# Altium project eBox_main.PrjPcb
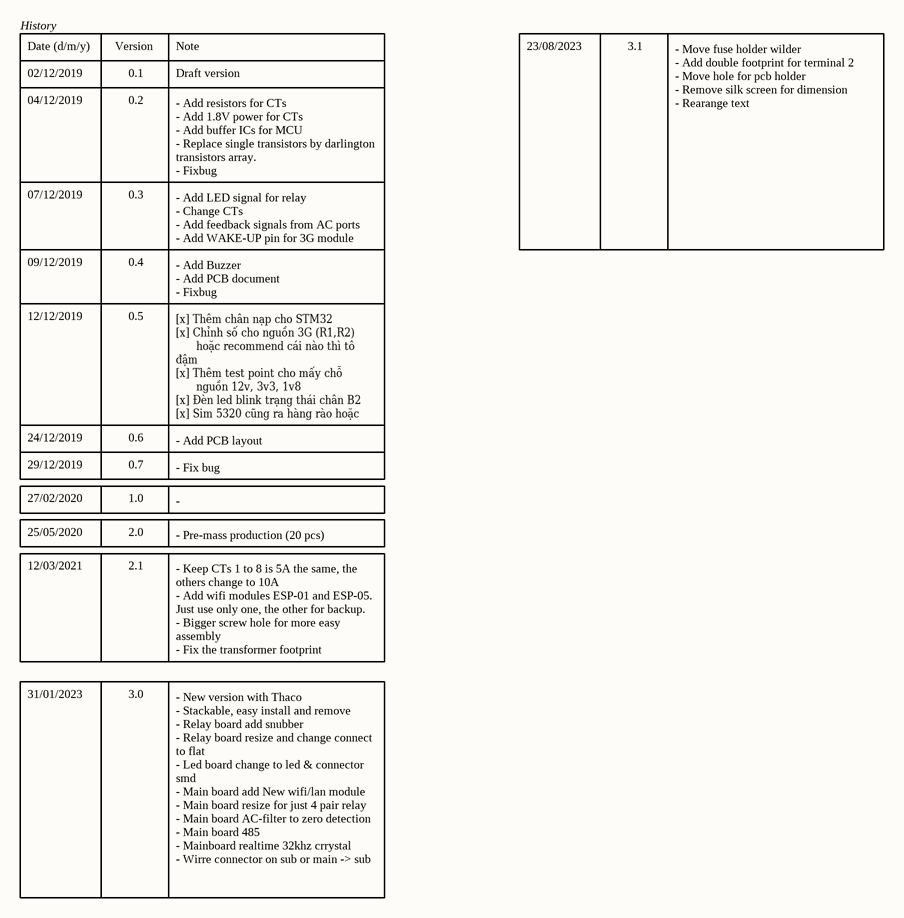
[diagram p0: eBox_Notes.SchDoc]
Version: 2.1; Hash: zVBbq2tk
3 sheets, 52 parts. Net scope: flat (ports and power ports of the same name join across sheets).
Board file: eBox_main.PcbDoc
Sheets:
  eBox_Notes.SchDoc
  eBox_3G.SchDoc
  eBox_ACdetect2.SchDoc

## Sheet eBox_Notes.SchDoc: eBox_Notes
size A4; DocumentNumber: 1; SheetNumber: 1; SheetTotal: 9

### Notes on the sheet
- History
- Date (d/m/y)
- 02/12/2019
- Version
- 0.1
- Note
- Draft version
- 23/08/2023
- 3.1
- 04/12/2019
- 0.2
- 07/12/2019
- 0.3
- - Add resistors for CTs
  - Add 1.8V power for CTs
  - Add buffer ICs for MCU
  - Replace single transistors by darlington  transistors array.
  - Fixbug
- - Move fuse holder wilder
  - Add double footprint for terminal 2
  - Move hole for pcb holder
  - Remove silk screen for dimension
  - Rearange text
- 09/12/2019
- 0.4
- - Add LED signal for relay
  - Change CTs
  - Add feedback signals from AC ports
  - Add WAKE-UP pin for 3G module
- 12/12/2019
- 0.5
- - Add Buzzer
  - Add PCB document
  - Fixbug
- [x] Thêm chân nạp cho STM32
  [x] Chỉnh số cho nguồn 3G (R1,R2)
  hoặc recommend cái nào thì tô đậm
  [x] Thêm test point cho mấy chỗ
  nguồn 12v, 3v3, 1v8
  [x] Đèn led blink trạng thái chân B2
  [x] Sim 5320 cũng ra hàng rào hoặc
  test point uart để test
- 24/12/2019
- 29/12/2019
- 0.6
- 0.7
- - Add PCB layout
- - Fix bug
- 27/02/2020
- 25/05/2020
- 1.0
- 2.0
- -
- - Pre-mass production (20 pcs)
- 12/03/2021
- 2.1
- - Keep CTs 1 to 8 is 5A the same, the others change to 10A
  - Add wifi modules ESP-01 and ESP-05. Just use only one, the other for backup.
  - Bigger screw hole for more easy assembly
  - Fix the transformer footprint
  - Use 5V power supply for the temperature sensor
- 31/01/2023
- 3.0
- - New version with Thaco
  - Stackable, easy install and remove
  - Relay board add snubber
  - Relay board resize and change connect to flat
  - Led board change to led & connector smd
  - Main board add New wifi/lan module
  - Main board resize for just 4 pair relay
  - Main board AC-filter to zero detection
  - Main board 485
  - Mainboard realtime 32khz crrystal
  - Wirre connector on sub or main -> sub
  - Main board remove 2 adc pins
  - Main board adc read  tight to ground and remove 1v8?
- Title
- Size:
- Date:
- A4
- Number:
- Time:
- Revision:
- Sheet
- of
- NPN
- Lab
- File:

## Sheet eBox_3G.SchDoc: eBox_3G
size A4; DocumentNumber: 5; SheetNumber: 5; SheetTotal: 9
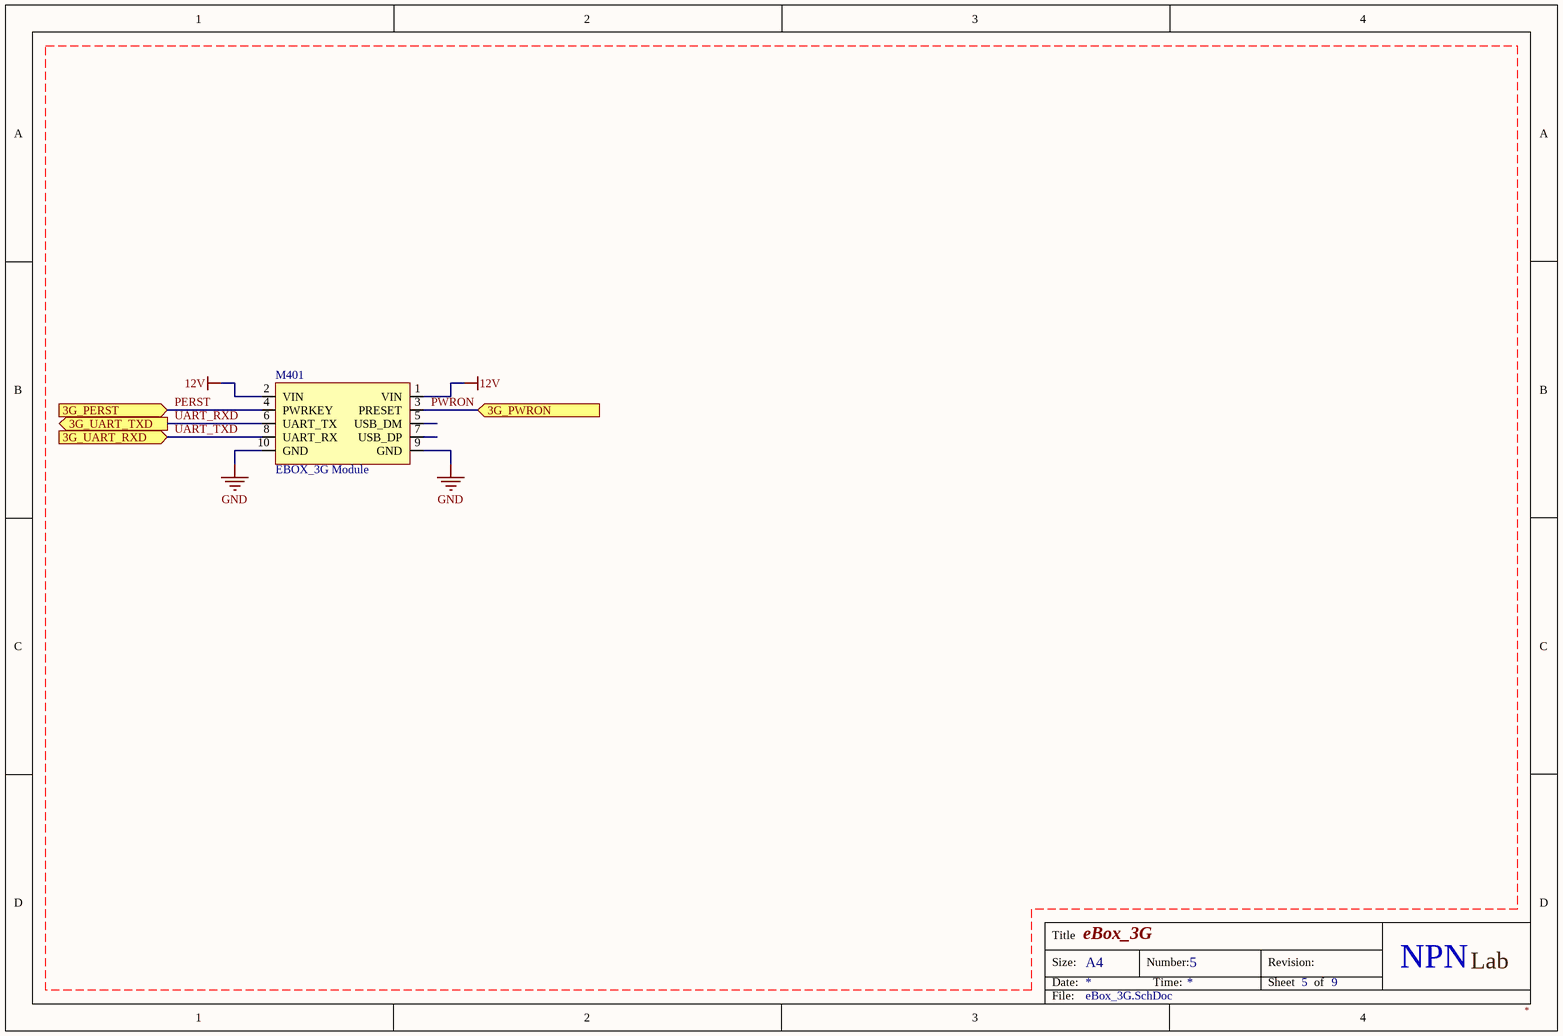
[diagram p1: eBox_3G.SchDoc]

### Parts
M401  EBOX_3G Module  [EBOX_3G]

### Ports
3G_PERST (in), 3G_PWRON (in), 3G_UART_RXD (in), 3G_UART_TXD (out)

### Nets
12V: M401.1(VIN) M401.2(VIN)
GND: M401.9(GND) M401.10(GND)
PERST: M401.4(PWRKEY) ; port 3G_PERST
PWRON: M401.3(PRESET) ; port 3G_PWRON
UART_RXD: M401.6(UART_TX) ; port 3G_UART_TXD
UART_TXD: M401.8(UART_RX) ; port 3G_UART_RXD

Not connected (* = marked no-connect by the designer): M401 5(USB_DM) 7(USB_DP)

### Notes on the sheet
- Title
- Size:
- Date:
- A4
- Number:
- Time:
- Revision:
- Sheet
- of
- NPN
- Lab
- File:

## Sheet eBox_ACdetect2.SchDoc: eBox_AC_Detect (2)
size A4; DocumentNumber: 7; SheetNumber: 7; SheetTotal: 9
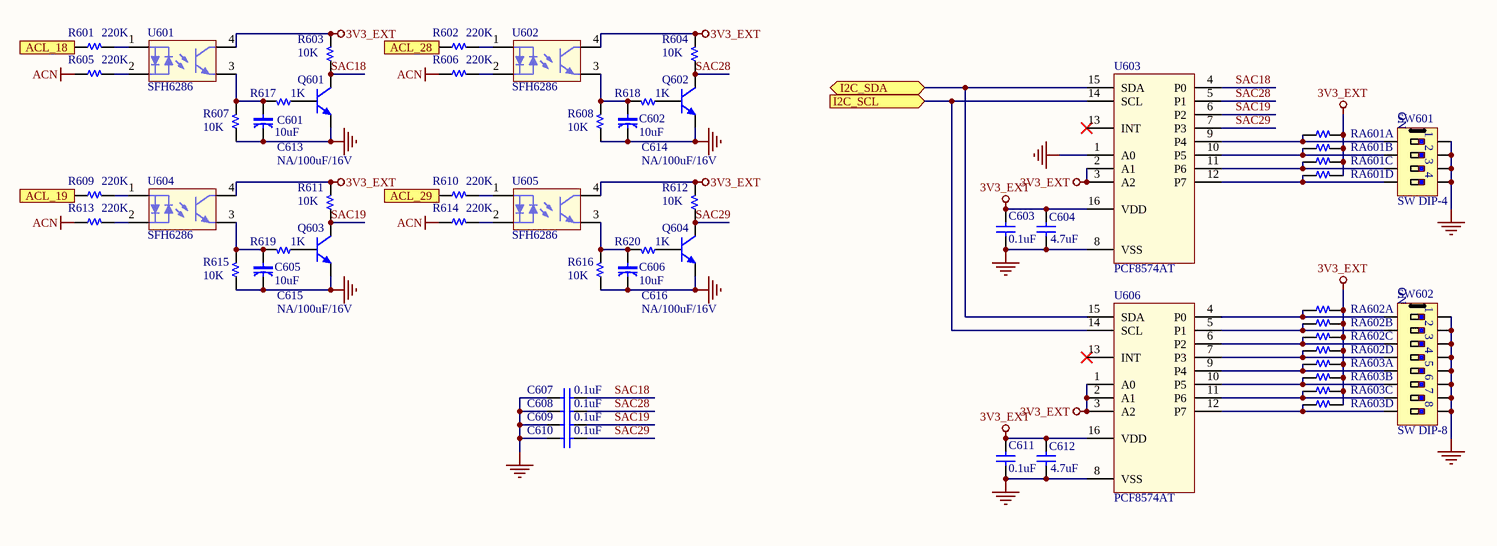
[diagram p2: eBox_ACdetect2.SchDoc]

### Parts
C601  10uF  [C 0805]
C602  10uF  [C 0805]
C603  0.1uF  [C 0603]
C604  4.7uF  [C 0603]
C605  10uF  [C 0805]
C606  10uF  [C 0805]
C607  0.1uF  [C 0805]
C608  0.1uF  [C 0805]
C609  0.1uF  [C 0805]
C610  0.1uF  [C 0805]
C611  0.1uF  [C 0603]
C612  4.7uF  [C 0603]
C613  NA/100uF/16V  [CYL/D.200/LS.75]
C614  NA/100uF/16V  [CYL/D.200/LS.75]
C615  NA/100uF/16V  [CYL/D.200/LS.75]
C616  NA/100uF/16V  [CYL/D.200/LS.75]
Q601  MMBT3904LT1G  [SOT-23]  (value not drawn)
Q602  MMBT3904LT1G  [SOT-23]  (value not drawn)
Q603  MMBT3904LT1G  [SOT-23]  (value not drawn)
Q604  MMBT3904LT1G  [SOT-23]  (value not drawn)
R601  220K  [R 0805]
R602  220K  [R 0805]
R603  10K  [R 0805]
R604  10K  [R 0805]
R605  220K  [R 0805]
R606  220K  [R 0805]
R607  10K  [R 0805]
R608  10K  [R 0805]
R609  220K  [R 0805]
R610  220K  [R 0805]
R611  10K  [R 0805]
R612  10K  [R 0805]
R613  220K  [R 0805]
R614  220K  [R 0805]
R615  10K  [R 0805]
R616  10K  [R 0805]
R617  1K  [R 0805]
R618  1K  [R 0805]
R619  1K  [R 0805]
R620  1K  [R 0805]
RA601  10K  [RAx4 1206 (3216)]  (value not drawn)  (parts A,B,C,D of 4)
RA602  10K  [RAx4 1206 (3216)]  (value not drawn)  (parts A,B,C,D of 4)
RA603  10K  [RAx4 1206 (3216)]  (value not drawn)  (parts A,B,C,D of 4)
SW601  SW DIP-4  [SW/DIP4]
SW602  SW DIP-8  [SW/DIP8/300]
U601  SFH6286  [SOP4 - SFH6286]
U602  SFH6286  [SOP4 - SFH6286]
U603  PCF8574AT  [SO16/PCF8574AT]
U604  SFH6286  [SOP4 - SFH6286]
U605  SFH6286  [SOP4 - SFH6286]
U606  PCF8574AT  [SO16/PCF8574AT]

### Ports
ACL_18 (in), ACL_19 (in), ACL_28 (in), ACL_29 (in), I2C_SCL (in), I2C_SDA (bidir)

### Nets
3V3_EXT: C603.1 C604.1 C611.1 C612.1 R603.2 R604.2 R611.2 R612.2 RA601.5 RA601.6 RA601.7 RA601.8 RA602.5 RA602.6 RA602.7 RA602.8 RA603.5 RA603.6 RA603.7 RA603.8 U601.4(C) U602.4(C) U603.2(A1) U603.3(A2) U603.16(VDD) U604.4(C) U605.4(C) U606.1(A0) U606.2(A1) U606.3(A2) U606.16(VDD)
ACN: R605.1 R606.1 R613.1 R614.1
GND: C601.2 C602.2 C603.2 C604.2 C605.2 C606.2 C607.1 C608.1 C609.1 C610.1 C611.2 C612.2 C613.2 C614.2 C615.2 C616.2 Q601.2(E) Q602.2(E) Q603.2(E) Q604.2(E) R607.1 R608.1 R615.1 R616.1 SW601.1 SW601.2 SW601.3 SW601.4 SW602.1 SW602.2 SW602.3 SW602.4 SW602.5 SW602.6 SW602.7 SW602.8 U603.1(A0) U603.8(VSS) U606.8(VSS)
SAC18: C607.2 Q601.3(C) R603.1 U603.4(P0)
SAC19: C609.2 Q603.3(C) R611.1 U603.6(P2)
SAC28: C608.2 Q602.3(C) R604.1 U603.5(P1)
SAC29: C610.2 Q604.3(C) R612.1 U603.7(P3)
NetC601_1: C601.1 C613.1 R607.2 R617.2 U601.3(E)
NetC602_1: C602.1 C614.1 R608.2 R618.2 U602.3(E)
NetC605_1: C605.1 C615.1 R615.2 R619.2 U604.3(E)
NetC606_1: C606.1 C616.1 R616.2 R620.2 U605.3(E)
NetQ601_1: Q601.1(B) R617.1
NetQ602_1: Q602.1(B) R618.1
NetQ603_1: Q603.1(B) R619.1
NetQ604_1: Q604.1(B) R620.1
NetR601_1: R601.1 ; port ACL_18
NetR601_2: R601.2 U601.1(A/C)
NetR602_1: R602.1 ; port ACL_28
NetR602_2: R602.2 U602.1(A/C)
NetR605_2: R605.2 U601.2(C/A)
NetR606_2: R606.2 U602.2(C/A)
NetR609_1: R609.1 ; port ACL_19
NetR609_2: R609.2 U604.1(A/C)
NetR610_1: R610.1 ; port ACL_29
NetR610_2: R610.2 U605.1(A/C)
NetR613_2: R613.2 U604.2(C/A)
NetR614_2: R614.2 U605.2(C/A)
NetRA601_1: RA601.1 SW601.8 U603.9(P4)
NetRA601_2: RA601.2 SW601.7 U603.10(P5)
NetRA601_3: RA601.3 SW601.6 U603.11(P6)
NetRA601_4: RA601.4 SW601.5 U603.12(P7)
NetRA602_1: RA602.1 SW602.16 U606.4(P0)
NetRA602_2: RA602.2 SW602.15 U606.5(P1)
NetRA602_3: RA602.3 SW602.14 U606.6(P2)
NetRA602_4: RA602.4 SW602.13 U606.7(P3)
NetRA603_1: RA603.1 SW602.12 U606.9(P4)
NetRA603_2: RA603.2 SW602.11 U606.10(P5)
NetRA603_3: RA603.3 SW602.10 U606.11(P6)
NetRA603_4: RA603.4 SW602.9 U606.12(P7)
NetU603_14: U603.14(SCL) U606.14(SCL) ; port I2C_SCL
NetU603_15: U603.15(SDA) U606.15(SDA) ; port I2C_SDA

Not connected (* = marked no-connect by the designer): U603 13(INT)*; U606 13(INT)*

### Notes on the sheet
- Title
- Size:
- Date:
- A4
- Number:
- Time:
- Revision:
- Sheet
- of
- NPN
- Lab
- File:
- (in symbol SW DIP-4) ON
- (in symbol SW DIP-8) ON

### Library data of the parts
C601 C602 C605-C610 = Capacitor NP: CAP CER 0.1UF 50V X7R 0805; TYPE: SMD; PACKAGE: SMD0805; STOCK CODE: CL21B104KBNC; SUPPLIER: tme.vn; STOCK DESC: 100nF/50V ±10% X7R SMD-0805 Capacitor; UNIT PRICE: 500
C603 C611 = Capacitor NP: CAP CER 0.1UF 50V X7R 0603; TYPE: SMD; PACKAGE: SMD0603; STOCK CODE: CC0603KRX7R9BB104; SUPPLIER: tme.vn; STOCK DESC: 100nF/50V ±10% X7R SMD-0603 Capacitor; UNIT PRICE: 400
C604 C612 = Capacitor NP: CAP CER 4.7UF 50V X7R 0603; TYPE: SMD; PACKAGE: SMD0603; STOCK CODE: CC0603KRX5R6BB475; SUPPLIER: tme.vn; STOCK DESC: 4.7uF 10V ±10% X5R SMD-0603 Capacitor; UNIT PRICE: 600
C613-C616 = Capacitor: CAP ALUM 100UF 20% 16V RADIAL; PACKAGE: 5x7 mm; STOCK CODE: 100uF/16V; SUPPLIER: tme.vn; TYPE: N/A; STOCK DESC: 100uF/16V ±20% Aluminum Electrolytic Capacitor, 5x7 mm; UNIT PRICE: 800
Q601-Q604 = Transistor NPN: TRANS NPN 40V 0.2A SOT23; TYPE: SMD; STOCK CODE: LMBT3904LT1G; SUPPLIER: tme.vn; STOCK DESC: NPN General-Purpose Amplifier SMD Transistor; UNIT PRICE: 600
R601 R602 R605 R606 R609 R610 R613 R614 = Resistor: RES SMD 220K OHM 1% 1/8W 0805; PACKAGE: SMD0805; STOCK CODE: RM10JTN224; SUPPLIER: tme.vn; TYPE: SMD; STOCK DESC: 220K 5% SMD-0805 Resistor; UNIT PRICE: 60
R603 R604 R607 R608 R611 R612 R615 R616 = Resistor: RES SMD 10K OHM 1% 1/8W 0805; PACKAGE: SMD0805; STOCK CODE: RM10JTN103; SUPPLIER: tme.vn; TYPE: SMD; STOCK DESC: 10K ±5% SMD-0805 Resistor; UNIT PRICE: 60
R617-R620 = Resistor: RES SMD 1K OHM 5% 1/8W 0805; PACKAGE: SMD0805; STOCK CODE: RM10JTN102; SUPPLIER: tme.vn; TYPE: SMD; STOCK DESC: 1K 5% SMD-0805 Resistor; UNIT PRICE: 60
RA601-RA603 = Resistor Array x4: 10K 1/10W 5% Chip Resistor Array (SMD0603x4); PACKAGE: SMD1206; STOCK CODE: 4D03WAJ0103T5E; SUPPLIER: tme.vn; TYPE: SMD; STOCK DESC: 10K 1/10W 5% Chip Resistor Array (SMD0603x4); UNIT PRICE: 150
U603 U606 = PCF8574AT: Remote 8-bit I/O expander for I2C-bus with interrupt; PART NO: PCF8574AT/3; BRAND: NXP; PACKAGE: SO16; SUPPLIER: CHINA; TYPE: SMD; UNIT PRICE: 6160
SW601 = SW DIP-4: PACKAGE: DIP8; STOCK CODE: DIPSW04-R; SUPPLIER: tme.vn; TYPE: TH; STOCK DESC: DIP Swich 4 Slide type, RED; UNIT PRICE: 3500
SW602 = SW DIP-8: PACKAGE: DIP16; STOCK CODE: DIPSW08-R; SUPPLIER: tme.vn; TYPE: TH; STOCK DESC: DIP Swich 8 Slide type, RED; UNIT PRICE: 4500
U601 U602 U604 U605 = SFH6286: SUPPLIER: CHINA; TYPE: SMD; UNIT PRICE: 3600

## Nets that join several sheets
GND: eBox_3G (M401.9 M401.10), eBox_ACdetect2 (39 pins)